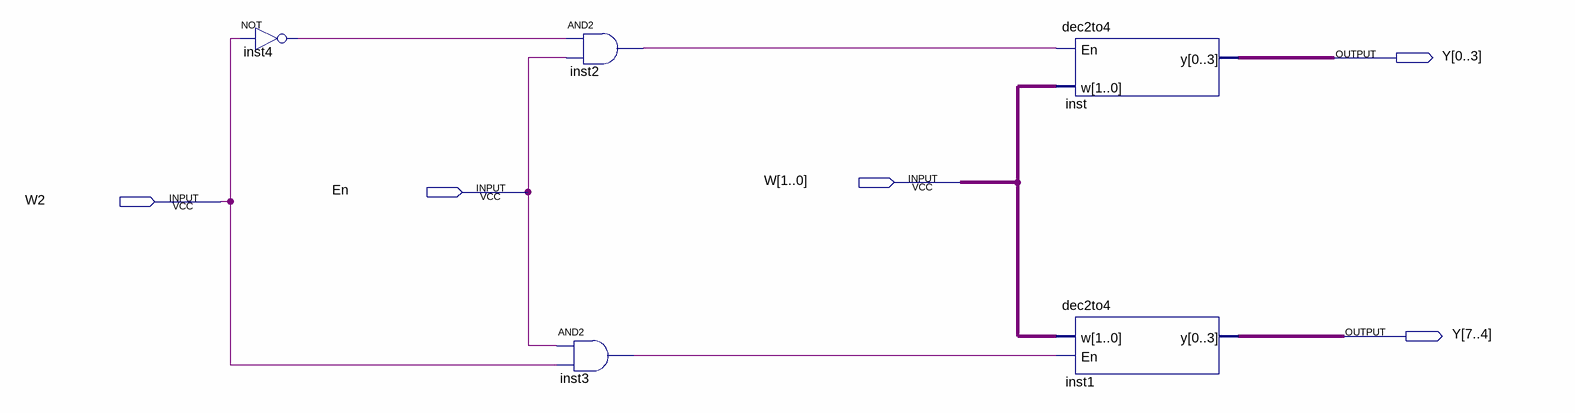
[diagram p0: schematic sheet]
// Quartus schematic decodModified.bdf as structural Verilog: 5 symbols, 5 pins
module decodModified (
  input  [1:0] W,
  input  En,
  input  W2,
  output [0:7] Y
);

  wire inst2_out, inst3_out, inst4_out;

  not inst4 (inst4_out, W2);
  and inst2 (inst2_out, inst4_out, En);
  and inst3 (inst3_out, En, W2);
  dec2to4 inst (.w(W), .En(inst2_out), .y(Y[0:3]));
  dec2to4 inst1 (.w(W), .En(inst3_out), .y({Y[7], Y[6], Y[5], Y[4]}));
endmodule
